# Altium project SingingBenchesPCB.PrjPcb
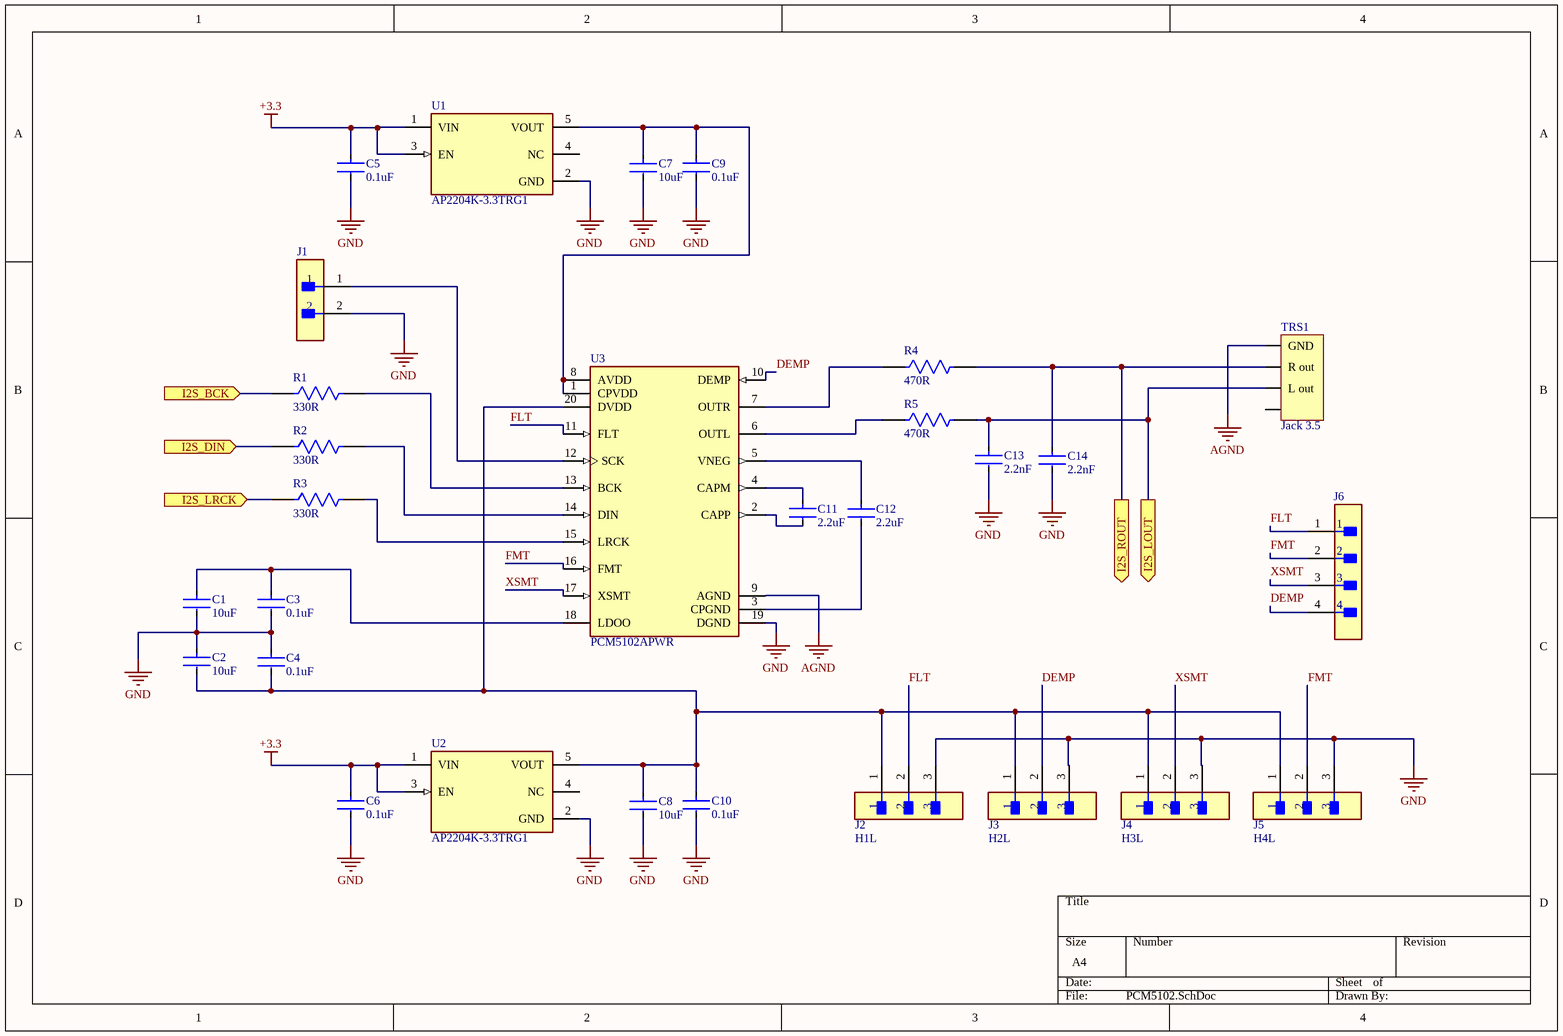
[diagram p0: PCM5102.SchDoc]
4 sheets, 117 parts. Net scope: flat (ports and power ports of the same name join across sheets).
Board file: PCB1.PcbDoc
Sheets:
  PCM5102.SchDoc
  TPA3116D2.SchDoc
  ESP32S3.SchDoc
  Power.SchDoc

## Sheet PCM5102.SchDoc
size A4; SheetNumber: 1; SheetTotal: 4

### Parts
C1  10uF  [FP-CL21-IPC_C]
C2  10uF  [FP-CL21-IPC_C]
C3  0.1uF  [FP-CL21-IPC_C]
C4  0.1uF  [FP-CL21-IPC_C]
C5  0.1uF  [FP-CL21-IPC_C]
C6  0.1uF  [FP-CL21-IPC_C]
C7  10uF  [FP-CL21-IPC_C]
C8  10uF  [FP-CL21-IPC_C]
C9  0.1uF  [FP-CL21-IPC_C]
C10  0.1uF  [FP-CL21-IPC_C]
C11  2.2uF  [FP-CL21-IPC_C]
C12  2.2uF  [FP-CL21-IPC_C]
C13  2.2nF  [FP-CL21-IPC_C]
C14  2.2nF  [FP-CL21-IPC_C]
J1  M22-2510205  [FP-M22-2510205-MFG]  (value not drawn)
J2  H1L  [FP-951103-8622-AR-MFG]
J3  H2L  [FP-951103-8622-AR-MFG]
J4  H3L  [FP-951103-8622-AR-MFG]
J5  H4L  [FP-951103-8622-AR-MFG]
J6  M20-9990445  [FP-M20-9990445-MFG]  (value not drawn)
R1  330R  [FP-RP732A-IPC_C]
R2  330R  [FP-RP732A-IPC_C]
R3  330R  [FP-RP732A-IPC_C]
R4  470R  [FP-RP732A-IPC_C]
R5  470R  [FP-RP732A-IPC_C]
TRS1  Jack 3.5  [PJ-327A]
U1  AP2204K-3.3TRG1  [FP-SOT25-IPC_C]
U2  AP2204K-3.3TRG1  [FP-SOT25-IPC_C]
U3  PCM5102APWR  [FP-PW0020A-IPC_A]

### Ports
I2S_BCK (in, see ESP32S3[2A]), I2S_DIN (in, see ESP32S3[2A]), I2S_LOUT (out, see TPA3116D2[1C]), I2S_LRCK (in, see ESP32S3[2A]), I2S_ROUT (out, see TPA3116D2[1B])

### Nets
+3.3: C5.1 C6.1 U1.1(VIN) U1.3(EN) U2.1(VIN) U2.3(EN)
AGND: TRS1.1(GND) U3.9(AGND)
GND: C1.2 C2.1 C3.2 C4.1 C5.2 C6.2 C7.2 C8.2 C9.2 C10.2 C13.2 C14.2 J1.2 J2.3 J3.3 J4.3 J5.3 U1.2(GND) U2.2(GND) U3.19(DGND)
DEMP: J3.2 J6.4 U3.10(DEMP)
FLT: J2.2 J6.1 U3.11(FLT)
FMT: J5.2 J6.2 U3.16(FMT)
IO4: R1.1 ; port I2S_BCK
IO5: R2.1 ; port I2S_DIN
IO6: R3.1 ; port I2S_LRCK
XSMT: J4.2 J6.3 U3.17(XSMT)
NetC1_1: C1.1 C3.1 U3.18(LDOO)
NetC2_2: C2.2 C4.2 C8.1 C10.1 J2.1 J3.1 J4.1 J5.1 U2.5(VOUT) U3.20(DVDD)
NetC7_1: C7.1 C9.1 U1.5(VOUT) U3.1(CPVDD) U3.8(AVDD)
NetC11_1: C11.1 U3.4(CAPM)
NetC11_2: C11.2 U3.2(CAPP)
NetC12_1: C12.1 U3.5(VNEG)
NetC12_2: C12.2 U3.3(CPGND)
NetC13_1: C13.1 R5.2 TRS1.3(L_out) ; port I2S_LOUT
NetC14_1: C14.1 R4.2 TRS1.2(R_out) ; port I2S_ROUT
NetJ1_1: J1.1 U3.12(SCK)
NetR1_2: R1.2 U3.13(BCK)
NetR2_2: R2.2 U3.14(DIN)
NetR3_2: R3.2 U3.15(LRCK)
NetR4_1: R4.1 U3.7(OUTR)
NetR5_1: R5.1 U3.6(OUTL)

Not connected (* = marked no-connect by the designer): TRS1 4; U1 4(NC); U2 4(NC)

### Library data of the parts
C1-C14 = CMP-13271-002689-1: CL21 Series 0805 47nF 50V ±5% Tolerance X7R Multilayer Ceramic Chip Capacitor; Voltage Rating (DC): 50V; Package Quantity: 10000; Height: 0.85mm; Max Operating Temperature: 125°C; Dielectric: X7R; Radiation Hardening: No; Mount: Surface Mount; Voltage Rating: 50V; Tolerance: 5%; Depth: 1.25mm; Min Operating Temperature: -55°C; Width: 0.049inch; Case/Package: 0805; Length: 2mm; Packaging: Tape and Reel; Thickness: 0.037inch
  C1 C2 C7 C8: Capacitance: 10uF
  C3-C6 C9 C10: Capacitance: 0.1uF
  C11 C12: Capacitance: 2.2uF
  C13 C14: Capacitance: 2.2nF
J1 = CMP-15831-000005-1: CONN HEADER VERT 2POS 2MM; Manufacturer: Harwin; Conn Gender: Male; Current Rating: 2A; Number Of Contacts: 2; Conn Orientation: Vertical; Temperature Range Low: -40°C; Device Class L1: Connectors; ComponentLink2URL: https://cdn.harwin.com/pdfs/C018XX_M22_Series_Connectors.pdf; Temperature Range High: +105°C; Pitch: 2mm; Number Of Rows: 1; Temperature: -40°C to +105°C; Automotive: No; Device Class L3: unset; Octopart: https://octopart.com/m22-2510205-harwin-2538221; Mouser Description: Headers & Wire Housings 2 PIN SIL VERTICAL GOLD PIN HEADER; Height: 5.45mm; Category: Conn; Digikey Description: CONN HEADER VERT 2POS 2MM; Contact Material: Gold,Nickel; Lead Free: Yes; ComponentLink2Description: Datasheet; Manufacturer Part Number: M22-2510205; Device Class L2: Headers and Wire Housings; Package: 0; Footprint Url: https://cdn.harwin.com/pdfs/M22-251.pdf; RoHS: TRUE
J2-J5 = CMP-05379-000003-1: CONN HEADER VERT 3POS 2MM; Manufacturer Part Number: 951103-8622-AR; Manufacturer: 3M; Conn Gender: Male; Current Rating: 2A; Number Of Contacts: 3; Conn Orientation: Straight; Digikey Description: CONN HEADER VERT 3POS 2MM; Device Class L3: unset; Category: Conn; Height: 6.3mm; RoHS: TRUE; Contact Material: Gold,Nickel; ComponentLink2Description: Datasheet; Temperature Range Low: -55°C; Device Class L1: Connectors; Pitch: 2mm; Mouser Description: Header; PinStrip; CopperAlloy; HighTempThermoplastic; 3Cnts; 1A; RtAngle; 951Series; Octopart: https://octopart.com/951103-8622-ar-3m-14400669; Package: 951103-8622-AR; Lead Free: Yes; Device Class L2: Headers and Wire Housings; Temperature Range High: +125°C; ComponentLink2URL: http://multimedia.3m.com/mws/media/1400506O/3m-pin-strip-header-951-series-78-5100-2653-3.pdf; Automotive: No; Temperature: -55°C to +125°C; Number Of Rows: 1
J6 = CMP-00671-05399696-1: M20-9990445 Conn Unshrouded Header HDR 4 POS 2.54mm Solder ST Thru-Hole Bulk/Loose; Insulation Resistance: 10GΩ; Connector Type: Male Pin; Voltage Rating (DC): 750V; Max Current Rating: 3A; Contact Resistance: 25mΩ; Number of Contacts: 4; Gender: Male; Color: Black; Height: 2.54mm; Contact Material: Brass, Bronze, Gold, Nickel; Orientation: Straight; Width: 12.7mm; Mount: Through Hole; Pitch: 2.54mm; Lead Pitch: 2.54mm; RoHS: Compliant; Max Operating Temperature: 105°C; Case/Package: SIL; NexarPartId: 5399696; Depth: 2.54mm; Length: 10.16mm; Current Rating: 3A; Contact Plating: Gold; Radiation Hardening: No; Contact Mating Length: 6.096mm; Voltage Rating (AC): 750V; Termination: Solder; REACH SVHC: No SVHC; Weight: 45.359237g; Number of Rows: 1; Min Operating Temperature: -40°C; Housing Material: Nylon; Housing Color: Black; Number of Positions: 4; Number of Pins: 4
R1-R5 = CMP-03211-008429-2: Surface Mount Resistors, Precision Resistor, 2 Terminations, Size Code 0805, Cut Tape Length, .1%, Thin Film, 10K 0.1% 10PPM; Temperature Coefficient: 15ppm/°C; Number of Resistors: 1; Power Rating: 125mW; Voltage Rating (DC): 150V; REACH SVHC: No SVHC; Height: 0.55mm; Number of Pins: 2; ELV: Compliant; Termination: Solder; Number of Terminations: 2; Case Code (Imperial): 0805; Mount: Surface Mount; Case/Package: 0805; Case Code (Metric): 2012; Length: 2mm; Packaging: Cut Tape; Composition: Thin Film; Max Operating Temperature: 155°C; Tolerance: 0.1%; Min Operating Temperature: -55°C; Package Quantity: 250; Width: 1.25mm; Voltage Rating: 150V; Weight: 0.000194oz
  R1-R3: Resistance: 330R
  R4 R5: Resistance: 470R
TRS1 = PJ327A
U1 U2 = CMP-2000-05782-2: IC REG LINEAR 3.3V 150MA SOT23-5; Max Input Voltage: 24V; Min Input Voltage: 2.3V; Quiescent Current: 50uA; Number of Regulators: 1; Max Output Current: 250mA; Reference Voltage: 1.24V; Output Type: Fixed; Polarity: Positive; Dropout Voltage: 360mV; Weight: 0.001058oz; Min Operating Temperature: -40°C; Output Current: 150mA; Lead Free: Lead Free; Length: 3.02mm; Height: 1.3mm; Width: 1.7mm; Case/Package: SOT-23-5; Max Operating Temperature: 85°C; Package Quantity: 3000; Mount: Surface Mount; Output Voltage: 3.3V; Number of Pins: 5; Packaging: Tape and Reel; Number of Outputs: 1
U3 = CMP-04861-000013-1: IC DAC 16/24/32BIT 384K 20TSSOP; Power Consumption: 59.4mW; Number of Analog Inputs: 0; Supply Type: Analog; Resolution: 32b; Number of Analog Outputs: 2; Max Power Dissipation: 187mW; Sampling Rate: 384KS/s; Operating Supply Voltage: 3.3V; Number of Bits: 32; Max Supply Voltage: 3.6V; Interface: Serial; Polarity: Unipolar; Min Supply Voltage: 3V; Output Type: Voltage; Signal to Noise Ratio (SNR): 112dB; Contact Plating: Gold; Package Quantity: 2000; Number of Pins: 20; Max Operating Temperature: 85°C; Series: DirectPath™; Case/Package: TSSOP; Conversion Rate: 384KS/s; Number of DAC Channels: 2; Mount: Surface Mount; REACH SVHC: No SVHC; Packaging: Tape and Reel; Number of Converters: 2; Min Operating Temperature: -25°C; Lead Free: Lead Free

## Sheet TPA3116D2.SchDoc
size A4; SheetNumber: 2; SheetTotal: 4
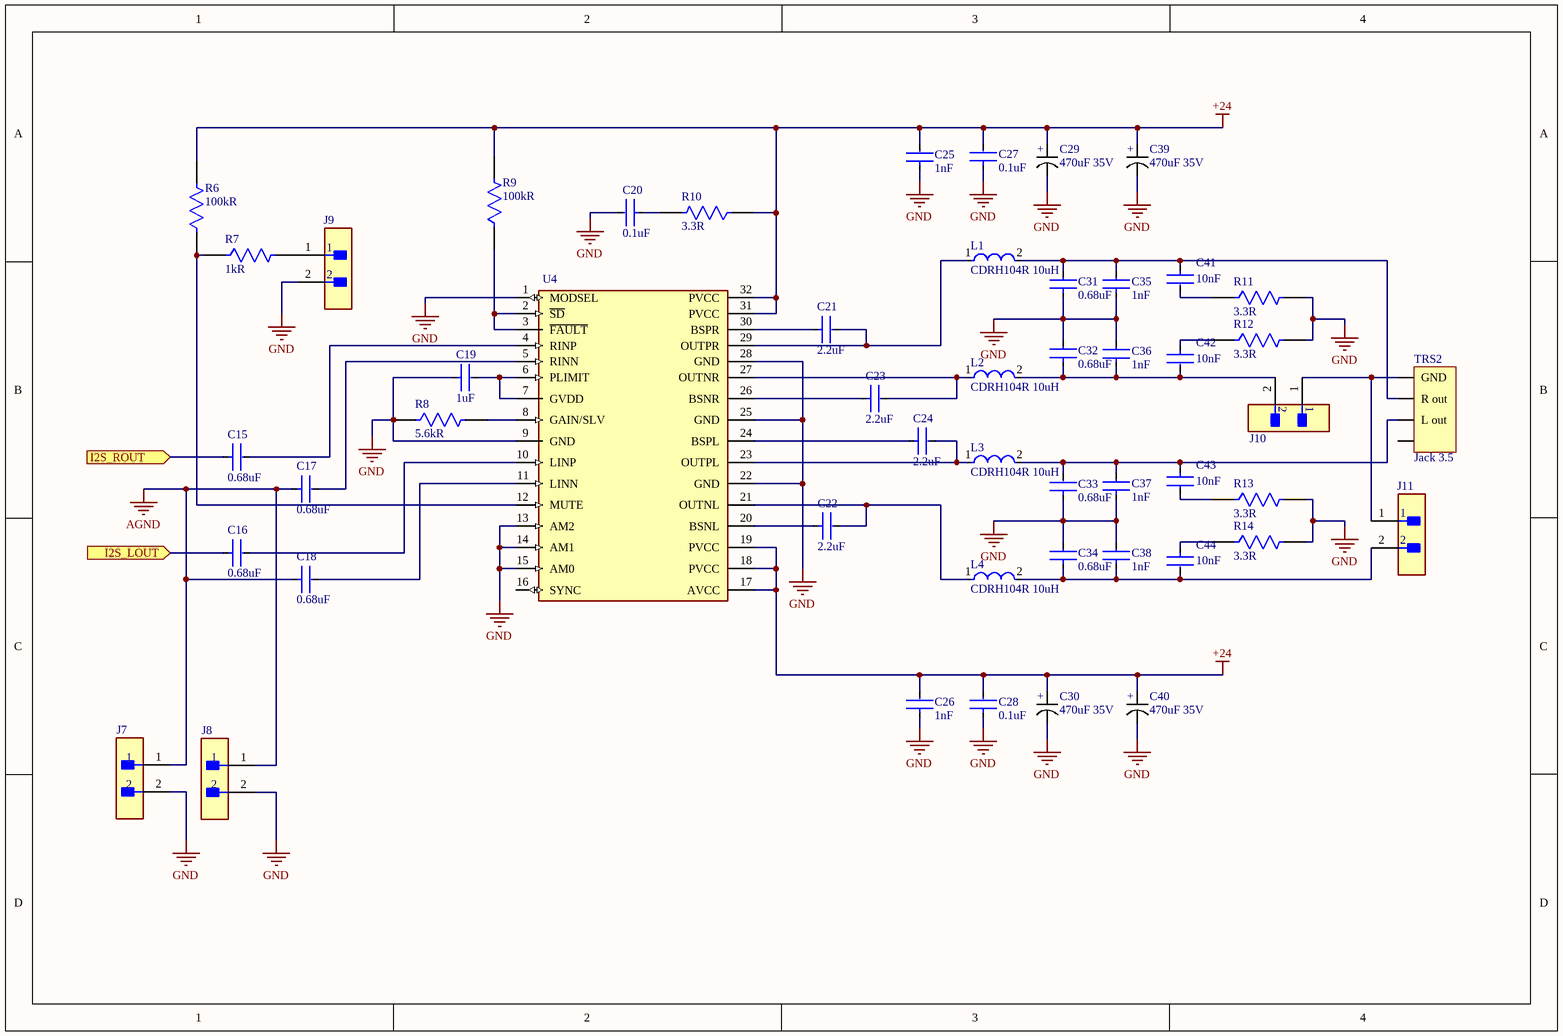
[diagram p1: TPA3116D2.SchDoc]

### Parts
C15  0.68uF  [FP-CL21-IPC_C]
C16  0.68uF  [FP-CL21-IPC_C]
C17  0.68uF  [FP-CL21-IPC_C]
C18  0.68uF  [FP-CL21-IPC_C]
C19  1uF  [FP-CL21-IPC_C]
C20  0.1uF  [FP-CL21-IPC_C]
C21  2.2uF  [FP-CL21-IPC_C]
C22  2.2uF  [FP-CL21-IPC_C]
C23  2.2uF  [FP-CL21-IPC_C]
C24  2.2uF  [FP-CL21-IPC_C]
C25  1nF  [FP-CL21-IPC_C]
C26  1nF  [FP-CL21-IPC_C]
C27  0.1uF  [FP-CL21-IPC_C]
C28  0.1uF  [FP-CL21-IPC_C]
C29  470uF 35V  [CAP VT 470uF 35V]
C30  470uF 35V  [CAP VT 470uF 35V]
C31  0.68uF  [FP-CL21-IPC_C]
C32  0.68uF  [FP-CL21-IPC_C]
C33  0.68uF  [FP-CL21-IPC_C]
C34  0.68uF  [FP-CL21-IPC_C]
C35  1nF  [FP-CL21-IPC_C]
C36  1nF  [FP-CL21-IPC_C]
C37  1nF  [FP-CL21-IPC_C]
C38  1nF  [FP-CL21-IPC_C]
C39  470uF 35V  [CAP VT 470uF 35V]
C40  470uF 35V  [CAP VT 470uF 35V]
C41  10nF  [FP-CL21-IPC_C]
C42  10nF  [FP-CL21-IPC_C]
C43  10nF  [FP-CL21-IPC_C]
C44  10nF  [FP-CL21-IPC_C]
J7  M22-2510205  [FP-M22-2510205-MFG]  (value not drawn)
J8  M22-2510205  [FP-M22-2510205-MFG]  (value not drawn)
J9  M22-2510205  [FP-M22-2510205-MFG]  (value not drawn)
J10  M22-2510205  [FP-M22-2510205-MFG]  (value not drawn)
J11  M22-2510205  [FP-M22-2510205-MFG]  (value not drawn)
L1  CDRH104R 10uH  [FP-CDRH104R-MFG]
L2  CDRH104R 10uH  [FP-CDRH104R-MFG]
L3  CDRH104R 10uH  [FP-CDRH104R-MFG]
L4  CDRH104R 10uH  [FP-CDRH104R-MFG]
R6  100kR  [FP-RP732A-IPC_C]
R7  1kR  [FP-RP732A-IPC_C]
R8  5.6kR  [FP-RP732A-IPC_C]
R9  100kR  [FP-RP732A-IPC_C]
R10  3.3R  [FP-RP732A-IPC_C]
R11  3.3R  [FP-RP732A-IPC_C]
R12  3.3R  [FP-RP732A-IPC_C]
R13  3.3R  [FP-RP732A-IPC_C]
R14  3.3R  [FP-RP732A-IPC_C]
TRS2  Jack 3.5  [PJ-327A]
U4  TPA3116D2QDADRQ1  [FP-DAD0032C-MFG]  (value not drawn)

### Ports
I2S_LOUT (in, see PCM5102[3C]), I2S_ROUT (in, see PCM5102[3C])

### Nets
+24: C25.2 C26.2 C27.2 C28.2 C29.1(+) C30.1(+) C39.1(+) C40.1(+) R6.2 R9.2 R10.1 U4.17(AVCC) U4.18(PVCC) U4.19(PVCC) U4.31(PVCC) U4.32(PVCC)
AGND: C17.1 C18.1 J7.1 J8.1
GND: C19.1 C20.2 C25.1 C26.1 C27.1 C28.1 C29.2(-) C30.2(-) C31.1 C32.2 C33.1 C34.2 C35.1 C36.2 C37.1 C38.2 C39.2(-) C40.2(-) J7.2 J8.2 J9.2 R8.1 R11.2 R12.2 R13.2 R14.2 U4.1(MODSEL) U4.9(GND) U4.13(AM2) U4.14(AM1) U4.15(AM0) U4.22(GND) U4.25(GND) U4.28(GND)
NetC13_1: C16.1 ; port I2S_LOUT
NetC14_1: C15.1 ; port I2S_ROUT
NetC15_2: C15.2 U4.4(RINP)
NetC16_2: C16.2 U4.10(LINP)
NetC17_2: C17.2 U4.5(RINN)
NetC18_2: C18.2 U4.11(LINN)
NetC19_2: C19.2 U4.6(PLIMIT) U4.7(GVDD)
NetC20_1: C20.1 R10.2
NetC21_1: C21.1 U4.30(BSPR)
NetC21_2: C21.2 L1.1 U4.29(OUTPR)
NetC22_1: C22.1 U4.20(BSNL)
NetC22_2: C22.2 L4.1 U4.21(OUTNL)
NetC23_1: C23.1 U4.26(BSNR)
NetC23_2: C23.2 L2.1 U4.27(OUTNR)
NetC24_1: C24.1 U4.24(BSPL)
NetC24_2: C24.2 L3.1 U4.23(OUTPL)
NetC31_2: C31.2 C35.2 C41.1 L1.2 TRS2.2(R_out)
NetC32_1: C32.1 C36.1 C42.2 J10.2 L2.2
NetC33_2: C33.2 C37.2 C43.1 L3.2 TRS2.3(L_out)
NetC34_1: C34.1 C38.1 C44.2 J11.2 L4.2
NetC41_2: C41.2 R11.1
NetC42_1: C42.1 R12.1
NetC43_2: C43.2 R13.1
NetC44_1: C44.1 R14.1
NetJ9_1: J9.1 R7.2
NetJ10_1: J10.1 J11.1 TRS2.1(GND)
NetR6_1: R6.1 R7.1 U4.12(MUTE)
NetR8_2: R8.2 U4.8(GAIN/SLV)
NetR9_1: R9.1 U4.2(~{SD}) U4.3(~{FAULT})

Not connected (* = marked no-connect by the designer): TRS2 4; U4 16(SYNC)

### Library data of the parts
C15-C28 C31-C38 C41-C44 = CMP-13271-002689-1: as C1 on sheet PCM5102; Voltage Rating (DC): 50V; Package Quantity: 10000; Height: 0.85mm; Max Operating Temperature: 125°C; Dielectric: X7R; Radiation Hardening: No; Mount: Surface Mount; Voltage Rating: 50V; Tolerance: 5%; Depth: 1.25mm; Min Operating Temperature: -55°C; Width: 0.049inch; Case/Package: 0805; Length: 2mm; Packaging: Tape and Reel; Thickness: 0.037inch
  C15-C18 C31-C34: Capacitance: 0.68uF
  C19: Capacitance: 1uF
  C20 C27 C28: Capacitance: 0.1uF
  C21-C24: Capacitance: 2.2uF
  C25 C26 C35-C38: Capacitance: 1nF
  C41-C44: Capacitance: 10nF
C29 C30 C39 C40 = Cap: VT 470uF 35V: Capacitance: 470uF; Voltage Rating (DC): 35V
J7-J11 = CMP-15831-000005-1: as J1 on sheet PCM5102; Temperature Range Low: -40°C; Device Class L1: Connectors; ComponentLink2URL: https://cdn.harwin.com/pdfs/C018XX_M22_Series_Connectors.pdf; Temperature Range High: +105°C; Pitch: 2mm; Number Of Rows: 1; Temperature: -40°C to +105°C; Automotive: No; Device Class L3: unset; Octopart: https://octopart.com/m22-2510205-harwin-2538221; Mouser Description: Headers & Wire Housings 2 PIN SIL VERTICAL GOLD PIN HEADER; Height: 5.45mm; Category: Conn; Digikey Description: CONN HEADER VERT 2POS 2MM; Contact Material: Gold,Nickel; Lead Free: Yes; ComponentLink2Description: Datasheet; Manufacturer Part Number: M22-2510205; Device Class L2: Headers and Wire Housings; Package: 0; Footprint Url: https://cdn.harwin.com/pdfs/M22-251.pdf; RoHS: TRUE
L1-L4 = CMP-48855-000006-1: FIXED IND 5.2UH 6A 22 MOHM SMD; Core Material: Ferrite; Max DC Current: 5.4A; Rated Current-Max: 5.5A; Test Frequency: 100kHz; Saturation Current: 5.6A; Tolerance: 30%; DC Resistance (DCR): 22mR; Shielding: Shielded; Depth: 10.3mm; Lead Free: Lead Free; Series: CDRH; Min Operating Temperature: -40°C; Mount: Surface Mount; Max Operating Temperature: 100°C; Termination: SMD/SMT; Width: 0.394inch; Radiation Hardening: No; Package Quantity: 1; Height: 4mm; Height - Seated (Max): 0.157inch; Military Standard: Not; Inductance: 10uH; Length: 10.5mm; Packaging: Tape and Reel; DC Current: 5.4A; Case/Package: Nonstandard; Current Rating: 5.4A
R6-R14 = CMP-03211-008429-2: as R1 on sheet PCM5102; REACH SVHC: No SVHC; Height: 0.55mm; Number of Pins: 2; ELV: Compliant; Termination: Solder; Number of Terminations: 2; Case Code (Imperial): 0805; Mount: Surface Mount; Case/Package: 0805; Case Code (Metric): 2012; Length: 2mm; Packaging: Cut Tape; Composition: Thin Film; Max Operating Temperature: 155°C; Tolerance: 0.1%; Min Operating Temperature: -55°C; Package Quantity: 250; Width: 1.25mm; Voltage Rating: 150V; Weight: 0.000194oz
  R6 R9: Resistance: 100kR
  R7: Resistance: 1kR
  R8: Resistance: 5.6kR
  R10-R14: Resistance: 3.3R
TRS2 = PJ327A
U4 = CMP-04894-000022-1: IC AMP CLASS D STER 50W 32HTSSOP; Min Supply Voltage: 4.5V; Max Supply Voltage: 26V; Voltage Gain: 36dB; Lead Free: Lead Free; Number of Pins: 32; Max Output Power: 50W; Mount: Surface Mount; Max Operating Temperature: 125°C; RoHS Compliant: Yes; Min Operating Temperature: -40°C; Case/Package: TSSOP; Packaging: Tape and Reel

## Sheet ESP32S3.SchDoc
size A4; SheetNumber: 3; SheetTotal: 4
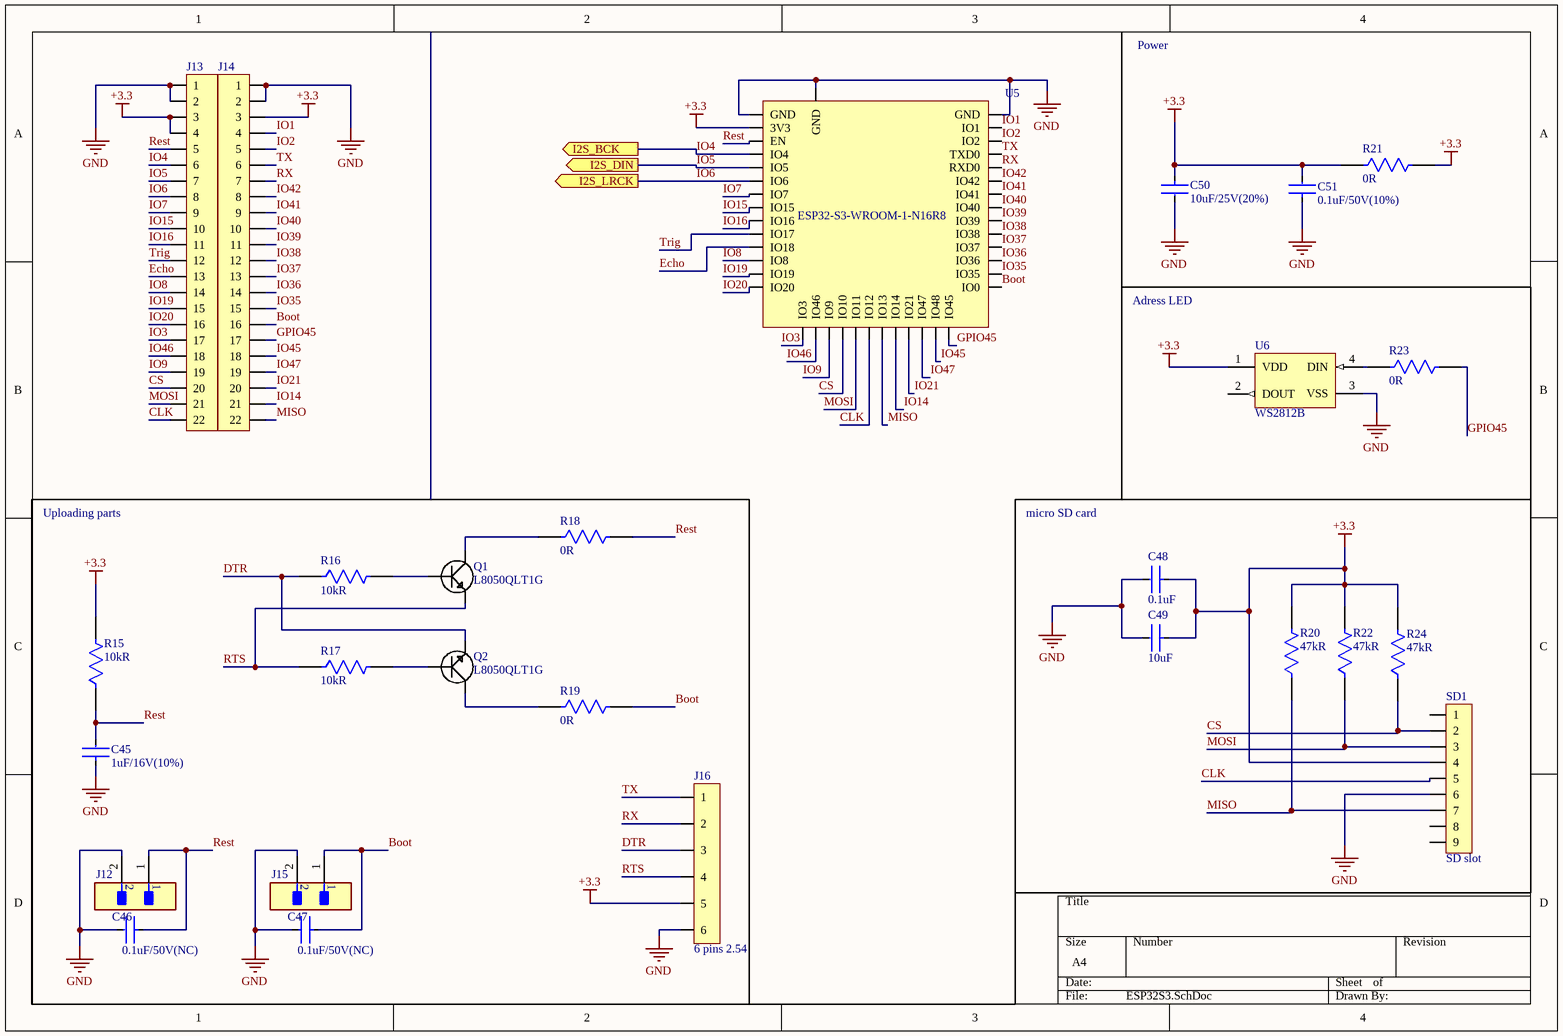
[diagram p2: ESP32S3.SchDoc]

### Parts
C45  1uF/16V(10%)  [FP-CL21-IPC_C]
C46  0.1uF/50V(NC)  [FP-CL21-IPC_C]
C47  0.1uF/50V(NC)  [FP-CL21-IPC_C]
C48  0.1uF  [FP-CL21-IPC_C]
C49  10uF  [FP-CL21-IPC_C]
C50  10uF/25V(20%)  [FP-CL21-IPC_C]
C51  0.1uF/50V(10%)  [FP-CL21-IPC_C]
J12  M22-2510205  [FP-M22-2510205-MFG]  (value not drawn)
J13  22 pins  [22 pins]  (value not drawn)
J14  22 pins  [22 pins]  (value not drawn)
J15  M22-2510205  [FP-M22-2510205-MFG]  (value not drawn)
J16  6 pins 2.54  [6 pins 2.54mm]
Q1  L8050QLT1G  [SOT95P245X110-3N]
Q2  L8050QLT1G  [SOT95P245X110-3N]
R15  10kR  [FP-RP732A-IPC_C]
R16  10kR  [FP-RP732A-IPC_C]
R17  10kR  [FP-RP732A-IPC_C]
R18  0R  [FP-RP732A-IPC_C]
R19  0R  [FP-RP732A-IPC_C]
R20  47kR  [FP-RP732A-IPC_C]
R21  0R  [FP-RP732A-IPC_C]
R22  47kR  [FP-RP732A-IPC_C]
R23  0R  [FP-RP732A-IPC_C]
R24  47kR  [FP-RP732A-IPC_C]
SD1  SD slot  [Micro SD slot]
U5  ESP32-S3-WROOM-1-N16R8  [ESP32_S3_Wroom1]
U6  WS2812B  [ADA-RGB-1655_V]

### Blocks framed on the sheet
Uploading parts: C45-C47 J12 J15 J16 Q1 Q2 R15-R19
micro SD card: C48 C49 R20 R22 R24 SD1

### Ports
I2S_BCK (out, see PCM5102[1B]), I2S_DIN (out, see PCM5102[1B]), I2S_LRCK (out, see PCM5102[1B])

### Nets
+3.3: C48.1 C49.1 C50.1 C51.2 J13.3 J13.4 J14.3 J16.5 R15.2 R20.2 R21.1 R21.2 R22.2 R24.2 SD1.4 U5.2(3V3) U6.1(VDD)
GND: C45.1 C46.2 C47.2 C48.2 C49.2 C50.2 C51.1 J12.2 J13.1 J13.2 J14.1 J14.2 J15.2 J16.6 SD1.6 U5.1(GND) U5.40(GND) U5.41(GND) U6.3(VSS)
Boot: C47.1 J14.16 J15.1 R19.2 U5.27(IO0)
CLK: J13.22 SD1.5 U5.20(IO12)
CS: J13.20 R24.1 SD1.2 U5.18(IO10)
DTR: J16.3 Q2.2(Emitter) R16.1
Echo: J13.13 U5.11(IO18)
GPIO45: J14.17 R23.2 U5.26(IO45)
IO1: J14.4 U5.39(IO1)
IO2: J14.5 U5.38(IO2)
IO3: J13.17 U5.15(IO3)
IO4: J13.6 U5.4(IO4) ; port I2S_BCK
IO5: J13.7 U5.5(IO5) ; port I2S_DIN
IO6: J13.8 U5.6(IO6) ; port I2S_LRCK
IO7: J13.9 U5.7(IO7)
IO8: J13.14 U5.12(IO8)
IO9: J13.19 U5.17(IO9)
IO14: J14.21 U5.22(IO14)
IO15: J13.10 U5.8(IO15)
IO16: J13.11 U5.9(IO16)
IO19: J13.15 U5.13(IO19)
IO20: J13.16 U5.14(IO20)
IO21: J14.20 U5.23(IO21)
IO35: J14.15 U5.28(IO35)
IO36: J14.14 U5.29(IO36)
IO37: J14.13 U5.30(IO37)
IO38: J14.12 U5.31(IO38)
IO39: J14.11 U5.32(IO39)
IO40: J14.10 U5.33(IO40)
IO41: J14.9 U5.34(IO41)
IO42: J14.8 U5.35(IO42)
IO45: J14.18 U5.25(IO48)
IO46: J13.18 U5.16(IO46)
IO47: J14.19 U5.24(IO47)
MISO: J14.22 R20.1 SD1.7 U5.21(IO13)
MOSI: J13.21 R22.1 SD1.3 U5.19(IO11)
Rest: C45.2 C46.1 J12.1 J13.5 R15.1 R18.2 U5.3(EN)
RTS: J16.4 Q1.2(Emitter) R17.1
RX: J14.7 J16.2 U5.36(RXD0)
Trig: J13.12 U5.10(IO17)
TX: J14.6 J16.1 U5.37(TXD0)
NetQ1_1: Q1.1(Base) R16.2
NetQ1_3: Q1.3(Collector) R18.1
NetQ2_1: Q2.1(Base) R17.2
NetQ2_3: Q2.3(Collector) R19.1
NetR23_1: R23.1 U6.4(DIN)

Not connected (* = marked no-connect by the designer): SD1 1 8 9; U6 2(DOUT)

### Notes on the sheet
- Power
- Adress LED

### Library data of the parts
C45 = CMP-13271-002689-1: CL21 Series 0805 47nF 50V ±5% Tolerance X7R Multilayer Ceramic Chip Capacitor; Voltage Rating (DC): 16V; Capacitance: 1uF; Package Quantity: 10000; Height: 0.85mm; Max Operating Temperature: 125°C; Dielectric: X7R; Radiation Hardening: No; Mount: Surface Mount; Voltage Rating: 50V; Tolerance: 5%; Depth: 1.25mm; Min Operating Temperature: -55°C; Width: 0.049inch; Case/Package: 0805; Length: 2mm; Packaging: Tape and Reel; Thickness: 0.037inch
C46 C47 C51 = CMP-13271-002689-1: CL21 Series 0805 47nF 50V ±5% Tolerance X7R Multilayer Ceramic Chip Capacitor; Capacitance: 0.1uF; Voltage Rating (DC): 50V; Package Quantity: 10000; Height: 0.85mm; Max Operating Temperature: 125°C; Dielectric: X7R; Radiation Hardening: No; Mount: Surface Mount; Voltage Rating: 50V; Tolerance: 5%; Depth: 1.25mm; Min Operating Temperature: -55°C; Width: 0.049inch; Case/Package: 0805; Length: 2mm; Packaging: Tape and Reel; Thickness: 0.037inch
C48 C49 = CMP-13271-002689-1: as C1 on sheet PCM5102; Voltage Rating (DC): 50V; Package Quantity: 10000; Height: 0.85mm; Max Operating Temperature: 125°C; Dielectric: X7R; Radiation Hardening: No; Mount: Surface Mount; Voltage Rating: 50V; Tolerance: 5%; Depth: 1.25mm; Min Operating Temperature: -55°C; Width: 0.049inch; Case/Package: 0805; Length: 2mm; Packaging: Tape and Reel; Thickness: 0.037inch
  C48: Capacitance: 0.1uF
  C49: Capacitance: 10uF
C50 = CMP-13271-002689-1: CL21 Series 0805 47nF 50V ±5% Tolerance X7R Multilayer Ceramic Chip Capacitor; Voltage Rating (DC): 25V; Capacitance: 10uF; Package Quantity: 10000; Height: 0.85mm; Max Operating Temperature: 125°C; Dielectric: X7R; Radiation Hardening: No; Mount: Surface Mount; Voltage Rating: 50V; Tolerance: 5%; Depth: 1.25mm; Min Operating Temperature: -55°C; Width: 0.049inch; Case/Package: 0805; Length: 2mm; Packaging: Tape and Reel; Thickness: 0.037inch
J12 J15 = CMP-15831-000005-1: as J1 on sheet PCM5102; Temperature Range Low: -40°C; Device Class L1: Connectors; ComponentLink2URL: https://cdn.harwin.com/pdfs/C018XX_M22_Series_Connectors.pdf; Temperature Range High: +105°C; Pitch: 2mm; Number Of Rows: 1; Temperature: -40°C to +105°C; Automotive: No; Device Class L3: unset; Octopart: https://octopart.com/m22-2510205-harwin-2538221; Mouser Description: Headers & Wire Housings 2 PIN SIL VERTICAL GOLD PIN HEADER; Height: 5.45mm; Category: Conn; Digikey Description: CONN HEADER VERT 2POS 2MM; Contact Material: Gold,Nickel; Lead Free: Yes; ComponentLink2Description: Datasheet; Manufacturer Part Number: M22-2510205; Device Class L2: Headers and Wire Housings; Package: 0; Footprint Url: https://cdn.harwin.com/pdfs/M22-251.pdf; RoHS: TRUE
R15-R24 = CMP-03211-008429-2: as R1 on sheet PCM5102; REACH SVHC: No SVHC; Height: 0.55mm; Number of Pins: 2; ELV: Compliant; Termination: Solder; Number of Terminations: 2; Case Code (Imperial): 0805; Mount: Surface Mount; Case/Package: 0805; Case Code (Metric): 2012; Length: 2mm; Packaging: Cut Tape; Composition: Thin Film; Max Operating Temperature: 155°C; Tolerance: 0.1%; Min Operating Temperature: -55°C; Package Quantity: 250; Width: 1.25mm; Voltage Rating: 150V; Weight: 0.000194oz
  R15-R17: Resistance: 10kR
  R18 R19 R21 R23: Resistance: 0R
  R20 R22 R24: Resistance: 47kR
U5 = ESP32-S3-WROOM-1-N16R8: SMD mod, ESP32-S3R8 with 3.3V, 8MB Octal PSRAM die insid, 6MBQuad SPI flash, pcb ant; Manufacturer: Espressif Systems; Supplier: Mouser; Supplier Part Number: 356-ESP32S3WRM1N16R8; Manufacturer Part Number: ESP32-S3-WROOM-1-N16R8; RoHS: No; Category: LDO; Pricing: 1=6,71, 10=6,15, 50=5,6, 100=5,03, 1000=4,3, 10000=4,3 (USD); ComponentLink1URL: https://datasheet.octopart.com/ESP32-S3-WROOM-1-N16R8-Espressif-Systems-datasheet-188867343.pdf?src-supplier=TME; ComponentLink1Description: https://datasheet.octopart.com/ESP32-S3-WROOM-1-N16R8-Espressif-Systems-datasheet-188867343.pdf?src-supplier=TME
U6 = CMP-2000-05026-1: Intelligent Control LED Integrated Light Source, 3.5 to 5.3 V, -25 to 80 degC, 4-Pin SMD, RoHS, Tape and Reel; Manufacturer: Adafruit-Industries-LLC; Number of LEDs: 10; Configuration: Discrete; Utilized LED: WS2812(5050); Datasheet URL: http://datasheet.octopart.com/ADA1655-Adafruit-Industries-datasheet-32028139.pdf; Series: Neopixel; Interface: -; Package Description: 4-Pin Surface Mount Device, Body 5 x 5 mm; Color: Red,Green,Blue(RGB); Category: Optoelectronics; Controller Type: -; Package Reference: 1655; Manufacturer URL: https://www.adafruit.com/; Mounting Type: SurfaceMount; Datasheet Version: May-13; Size / Dimension: 5.00mmLx5.00mmW; Family: Addressable,Specialty

## Sheet Power.SchDoc
size A4; SheetNumber: 4; SheetTotal: 4
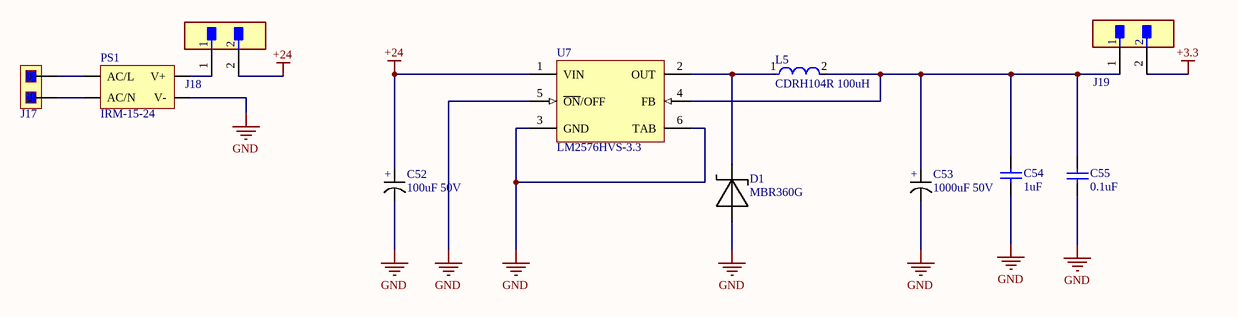
[diagram p3: Power.SchDoc]

### Parts
C52  100uF 50V  [CAP VT 100uF 50V]
C53  1000uF 50V  [CAP: dip 1000uF 50V]
C54  1uF  [CAPC2013X135X45ML10T25]
C55  0.1uF  [CAPC2013X135X45ML10T25]
D1  MBR360G  [MBR360G]
J17  KF301  [KF301-2P]  (value not drawn)
J18  M22-2510205  [FP-M22-2510205-MFG]  (value not drawn)
J19  M22-2510205  [FP-M22-2510205-MFG]  (value not drawn)
L5  CDRH104R 100uH  [FP-CDRH104R-MFG]
PS1  IRM-15-24  [IRM 15-24]
U7  LM2576HVS-3.3  [KTT0005B_L]

### Nets
+3.3: J19.2
+24: C52.1(+) J18.2 U7.1(VIN)
GND: C52.2(-) C53.2(-) C54.1 C55.1 D1.1 PS1.3(V-) U7.3(GND) U7.5(~{ON}/OFF) U7.6(TAB)
NetC53_1: C53.1(+) C54.2 C55.2 J19.1 L5.2 U7.4(FB)
NetD1_2: D1.2 L5.1 U7.2(OUT)
NetJ17_1: J17.1 PS1.1(AC/L)
NetJ17_2: J17.2 PS1.2(AC/N)
NetJ18_1: J18.1 PS1.4(V+)

### Library data of the parts
C52 = Cap: VT 100uF 50V: Capacitance: 100uF; Voltage Rating (DC): 50V
C53 = Cap: 1000uF 50V: Capacitance: 1000uF; Voltage Rating (DC): 50V
C54 C55 = CMP-2007-03607-1: Manufacturer: Murata; Part Number: GRM21BR72E103KW03L
  C54: Capacitance: 1uF
  C55: Capacitance: 0.1uF
D1 = MBR360G: Rectifier Diode, Schottky, 1 Phase, 1 Element, 3A, 60V V(RRM), Silicon, DO-201AD; Manufacturer: onsemi; Color: Green; Max Reverse Current: 600uA; Max Surge Current: 80A; Element Configuration: Single; Polarity: Standard; Lens Style: Diffused; Luminous Intensity: 15mcd; Power Rating: 52mW; Supplier: Avnet; Supplier Part Number: MBR360G; Manufacturer Part Number: MBR360G; RoHS: Yes; Category: Schottky Diodes; Stock: 279; Pricing: 500=0,16169, 510=0,15835, 1100=0,15514, 2500=0,15105, 5000=0,14813 (USD); Case/Package: DO-201AD; Pins: 2; Case Code (Imperial): 0603; Case Code (Metric): 1608; Min Operating Temperature: -65°C; Max Operating Temperature: 150°C; Forward Current: 3A; Package Quantity: 500; Packaging: Bulk; Max Reverse Leakage Current: 600uA; Average Rectified Current: 3A; Max Repetitive Reverse Voltage (Vrrm): 60V; Peak Non-Repetitive Surge Current: 80A; Max Forward Surge Current (Ifsm): 80A; Voltage Rating (DC): 60V; Current Rating: 3A; Output Current: 3A; Max Reverse Voltage (DC): 60V; Series: -; Illumination Color: Green; Breakdown Voltage: 60V; Diameter: 5.3mm; Length: 0.374inch; Width: 5.3mm; Height: 5.3mm; Radiation Hardening: No; Reach SVHC Compliant: No; Lead Free: Lead Free; Halogen Free: Halogen Free; RoHS Compliant: Yes; ComponentLink1URL: https://datasheet.ciiva.com/915/mbr350-d-915938.pdf?src-supplier=Avnet; ComponentLink1Description: https://datasheet.ciiva.com/915/mbr350-d-915938.pdf?src-supplier=Avnet; ComponentLink2URL: https://datasheet.ciiva.com/27050/886711-27050614.pdf?src-supplier=Jameco; ComponentLink2Description: https://datasheet.ciiva.com/27050/886711-27050614.pdf?src-supplier=Jameco; ComponentLink3URL: https://datasheet.ciiva.com/7962/85926-7962998.pdf?src-supplier=Element14; ComponentLink3Description: https://datasheet.ciiva.com/7962/85926-7962998.pdf?src-supplier=Element14; ComponentLink4URL: https://datasheet.ciiva.com/14560/70099825-14560826.pdf?src-supplier=Allied+Electronics; ComponentLink4Description: https://datasheet.ciiva.com/14560/70099825-14560826.pdf?src-supplier=Allied+Electronics
J17 = KF301-5.0-2P
J18 J19 = CMP-15831-000005-1: as J1 on sheet PCM5102; Temperature Range Low: -40°C; Device Class L1: Connectors; ComponentLink2URL: https://cdn.harwin.com/pdfs/C018XX_M22_Series_Connectors.pdf; Temperature Range High: +105°C; Pitch: 2mm; Number Of Rows: 1; Temperature: -40°C to +105°C; Automotive: No; Device Class L3: unset; Octopart: https://octopart.com/m22-2510205-harwin-2538221; Mouser Description: Headers & Wire Housings 2 PIN SIL VERTICAL GOLD PIN HEADER; Height: 5.45mm; Category: Conn; Digikey Description: CONN HEADER VERT 2POS 2MM; Contact Material: Gold,Nickel; Lead Free: Yes; ComponentLink2Description: Datasheet; Manufacturer Part Number: M22-2510205; Device Class L2: Headers and Wire Housings; Package: 0; Footprint Url: https://cdn.harwin.com/pdfs/M22-251.pdf; RoHS: TRUE
L5 = CMP-48855-000006-1: as L1 on sheet TPA3116D2; Depth: 10.3mm; Lead Free: Lead Free; Series: CDRH; Min Operating Temperature: -40°C; Mount: Surface Mount; Max Operating Temperature: 100°C; Termination: SMD/SMT; Width: 0.394inch; Radiation Hardening: No; Package Quantity: 1; Height: 4mm; Height - Seated (Max): 0.157inch; Military Standard: Not; Inductance: 100uH; Length: 10.5mm; Packaging: Tape and Reel; DC Current: 5.4A; Case/Package: Nonstandard; Current Rating: 5.4A
PS1 = IRM-15-24: AC to DC Power Supply Encapsulated Single Output 24 Volts 0.63 Amps 15.12 Watts; Manufacturer: Mean Well; Supplier: Arrow Electronics; Supplier Part Number: IRM-15-24; Manufacturer Part Number: IRM-15-24; RoHS: Yes; Category: Board Mount Modules; Stock: 2118; Pricing: 1=8,6, 5=8,24 (USD); ComponentLink1URL: https://datasheet.ciiva.com/48990/70387824-48990022.pdf?src-supplier=Allied+Electronics; ComponentLink1Description: https://datasheet.ciiva.com/48990/70387824-48990022.pdf?src-supplier=Allied+Electronics; ComponentLink2URL: https://datasheet.ciiva.com/30199/910irm-15-spec-30199847.pdf?src-supplier=Onlinecomponents.com; ComponentLink2Description: https://datasheet.ciiva.com/30199/910irm-15-spec-30199847.pdf?src-supplier=Onlinecomponents.com
U7 = CMP-0069-00094-3: SIMPLE SWITCHER® 1A Step-Down Voltage Regulator, 5-pin TO-263, Pb-Free; Manufacturer: Texas Instruments; PackageTopMarking: NSUZXYTTE#*LM2575HVS*-12 P+; PowerWise: N; CompType: Switcher; PinCount: 5; Code_JEDEC: MO-169-AB; PackageReference: KTT0005B; PackageDescription: TO-263, Molded, .400 x .390 x .180in, 5 Lead, .067in Pitch, Surface Mount; RoHS: Y; ComponentLink1Description: Datasheet URL; ComponentLink1URL: http://www.ti.com/general/docs/lit/getliterature.tsp?genericPartNumber=LM2575HV&fileType=pdf

## Nets that join several sheets
+3.3: PCM5102 (6 pins), ESP32S3 (17 pins), Power (J19.2)
+24: TPA3116D2 (16 pins), Power (C52.1 J18.2 U7.1)
AGND: PCM5102 (TRS1.1 U3.9), TPA3116D2 (C17.1 C18.1 J7.1 J8.1)
GND: PCM5102 (20 pins), TPA3116D2 (34 pins), ESP32S3 (19 pins), Power (9 pins)
IO4: PCM5102 (R1.1), ESP32S3 (J13.6 U5.4)
IO5: PCM5102 (R2.1), ESP32S3 (J13.7 U5.5)
IO6: PCM5102 (R3.1), ESP32S3 (J13.8 U5.6)
NetC13_1: PCM5102 (C13.1 R5.2 TRS1.3), TPA3116D2 (C16.1)
NetC14_1: PCM5102 (C14.1 R4.2 TRS1.2), TPA3116D2 (C15.1)